# Altium schematic sheet obc_main_3.0.SchDoc: OBC Main
size A; DrawnBy: Mohamed Hirole; Organization: UTAT SS; DocumentNumber: 1; Revision: 1.0; SheetNumber: 1; SheetTotal: 8
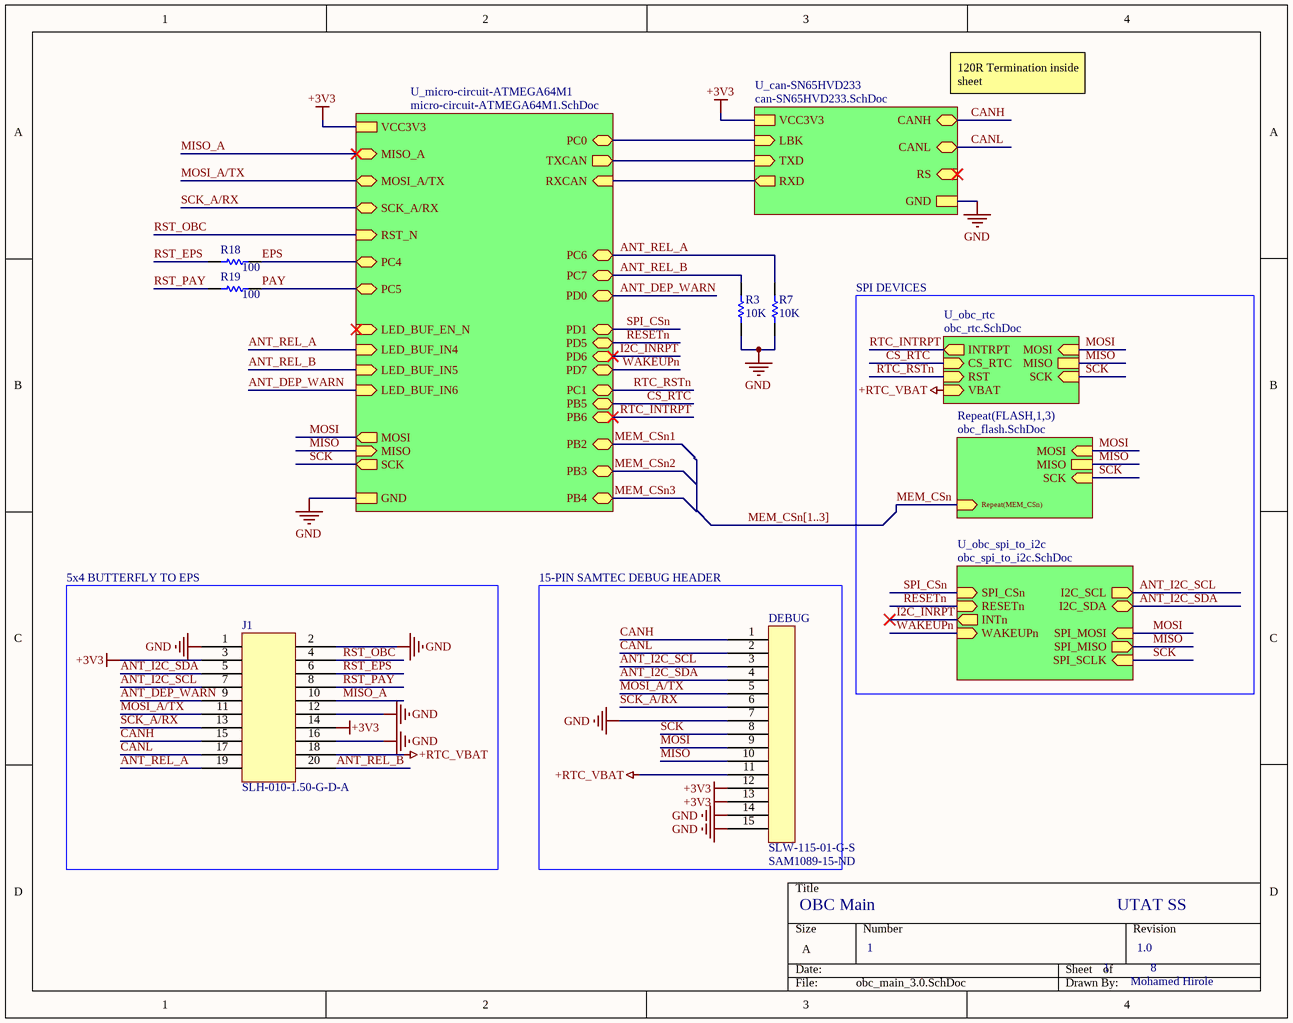
[diagram p0: obc_main_3.0.SchDoc]

## Parts
DEBUG  SLW-115-01-G-S  [SAM1089-15-ND]
J1  SLH-010-1.50-G-D-A  [SLH-010-1.50-G-D-A]
R3  value 10K  [RES0603R]  (hidden comment: 0603)
R7  value 10K  [RES0603R]  (hidden comment: 0603)
R18  value 100  [RES0603R]  (hidden comment: 0603)
R19  value 100  [RES0603R]  (hidden comment: 0603)

## Blocks framed on the sheet
5x4 BUTTERFLY TO EPS: J1
15-PIN SAMTEC DEBUG HEADER: DEBUG

## Sub-sheets
Repeat(FLASH,1,3) = obc_flash.SchDoc: MOSI (in), SCK (in), MISO, Repeat(MEM_CSn) (in)
U_can-SN65HVD233 = can-SN65HVD233.SchDoc: RXD (out), TXD (in), LBK (in), CANL (bidir), CANH (bidir), VCC3V3, GND, RS (in)
U_micro-circuit-ATMEGA64M1 = micro-circuit-ATMEGA64M1.SchDoc: MISO (in), MOSI (out), SCK (out), TXCAN (out), RXCAN (in), MISO_A (bidir), MOSI_A/TX (bidir), SCK_A/RX (bidir), PB2 (bidir), PB3 (bidir), PB4 (bidir), PB5 (bidir), PB6 (bidir), PC0 (bidir), PD0 (bidir), PC1 (bidir), PC4 (bidir), PC5 (bidir), PC6 (bidir), PC7 (bidir), PD1 (bidir), PD5 (bidir), PD6 (bidir), PD7 (bidir), RST_N (in), LED_BUF_EN_N (in), VCC3V3, GND, LED_BUF_IN4 (in), LED_BUF_IN5 (in), LED_BUF_IN6 (in)
U_obc_rtc = obc_rtc.SchDoc: CS_RTC (in), MOSI (in), MISO, SCK (in), INTRPT (out), VBAT (in), RST (in)
U_obc_spi_to_i2c = obc_spi_to_i2c.SchDoc: SPI_MOSI (in), I2C_SDA (bidir), INTn (out), WAKEUPn (in), RESETn (in), SPI_MISO (out), SPI_CSn (in), SPI_SCLK (in), I2C_SCL (out)

## Nets
+3V3: DEBUG.12 DEBUG.13 J1.3 J1.14 ; sheet U_micro-circuit-ATMEGA64M1/VCC3V3, sheet U_can-SN65HVD233/VCC3V3
+RTC_VBAT: DEBUG.11 J1.18 ; sheet U_obc_rtc/VBAT
GND: DEBUG.7 DEBUG.14 DEBUG.15 J1.1 J1.2 J1.12 J1.16 R3.1 R7.1 ; sheet U_micro-circuit-ATMEGA64M1/GND, sheet U_can-SN65HVD233/GND
ANT_DEP_WARN: J1.9 ; sheet U_micro-circuit-ATMEGA64M1/PD0, sheet U_micro-circuit-ATMEGA64M1/LED_BUF_IN6
ANT_I2C_SCL: DEBUG.3 J1.7 ; sheet U_obc_spi_to_i2c/I2C_SCL
ANT_I2C_SDA: DEBUG.4 J1.5 ; sheet U_obc_spi_to_i2c/I2C_SDA
ANT_REL_A: J1.19 R7.2 ; sheet U_micro-circuit-ATMEGA64M1/PC6, sheet U_micro-circuit-ATMEGA64M1/LED_BUF_IN4
ANT_REL_B: J1.20 R3.2 ; sheet U_micro-circuit-ATMEGA64M1/PC7, sheet U_micro-circuit-ATMEGA64M1/LED_BUF_IN5
CANH: DEBUG.1 J1.15 ; sheet U_can-SN65HVD233/CANH
CANL: DEBUG.2 J1.17 ; sheet U_can-SN65HVD233/CANL
CS_RTC: sheet U_obc_rtc/CS_RTC, sheet U_micro-circuit-ATMEGA64M1/PB5
EPS: R18.2 ; sheet U_micro-circuit-ATMEGA64M1/PC4
I2C_INRPT: sheet U_micro-circuit-ATMEGA64M1/PD6, sheet U_obc_spi_to_i2c/INTn
MEM_CSn: sheet Repeat(FLASH,1,3)/Repeat(MEM_CSn)
MEM_CSn1: sheet U_micro-circuit-ATMEGA64M1/PB2
MEM_CSn2: sheet U_micro-circuit-ATMEGA64M1/PB3
MEM_CSn3: sheet U_micro-circuit-ATMEGA64M1/PB4
MISO: DEBUG.10 ; sheet U_obc_rtc/MISO, sheet Repeat(FLASH,1,3)/MISO, sheet U_micro-circuit-ATMEGA64M1/MISO, sheet U_obc_spi_to_i2c/SPI_MISO
MISO_A: J1.10 ; sheet U_micro-circuit-ATMEGA64M1/MISO_A
MOSI: DEBUG.9 ; sheet U_obc_rtc/MOSI, sheet Repeat(FLASH,1,3)/MOSI, sheet U_micro-circuit-ATMEGA64M1/MOSI, sheet U_obc_spi_to_i2c/SPI_MOSI
MOSI_A/TX: DEBUG.5 J1.11 ; sheet U_micro-circuit-ATMEGA64M1/MOSI_A/TX
PAY: R19.2 ; sheet U_micro-circuit-ATMEGA64M1/PC5
RESETn: sheet U_micro-circuit-ATMEGA64M1/PD5, sheet U_obc_spi_to_i2c/RESETn
RST_EPS: J1.6 R18.1
RST_OBC: J1.4 ; sheet U_micro-circuit-ATMEGA64M1/RST_N
RST_PAY: J1.8 R19.1
RTC_INTRPT: sheet U_obc_rtc/INTRPT, sheet U_micro-circuit-ATMEGA64M1/PB6
RTC_RSTn: sheet U_obc_rtc/RST, sheet U_micro-circuit-ATMEGA64M1/PC1
SCK: DEBUG.8 ; sheet U_obc_rtc/SCK, sheet Repeat(FLASH,1,3)/SCK, sheet U_micro-circuit-ATMEGA64M1/SCK, sheet U_obc_spi_to_i2c/SPI_SCLK
SCK_A/RX: DEBUG.6 J1.13 ; sheet U_micro-circuit-ATMEGA64M1/SCK_A/RX
SPI_CSn: sheet U_micro-circuit-ATMEGA64M1/PD1, sheet U_obc_spi_to_i2c/SPI_CSn
WAKEUPn: sheet U_micro-circuit-ATMEGA64M1/PD7, sheet U_obc_spi_to_i2c/WAKEUPn
(unnamed): sheet U_micro-circuit-ATMEGA64M1/TXCAN, sheet U_can-SN65HVD233/TXD
(unnamed): sheet U_micro-circuit-ATMEGA64M1/RXCAN, sheet U_can-SN65HVD233/RXD
(unnamed): sheet U_micro-circuit-ATMEGA64M1/PC0, sheet U_can-SN65HVD233/LBK

## Buses and harness runs
bus MEM_CSn[1..3]

## Notes on the sheet
- 120R Termination inside sheet
- SPI DEVICES

## Library data of the parts
DEBUG = SLW-115-01-G-S: 15 Position Receptacle Connector 0.100" (2.54mm) Through Hole Gold; Manufacturer: Samtec; Max Current Rating: 7.1A; Contact Resistance: 10mR; Number of Positions: 15; Max Voltage Rating (AC): 550V; Gender: Female; Supplier 1: Digi-Key; Manufacturer Part Number: SLW-115-01-G-S; Stock 1: 0; Pricing 1: 1=2.44, 10=2.214, 25=2.0784, 50=1.988, 100=1.8976, 250=1.71684, 500=1.5813 (USD); Mount: Through Hole; Contact Plating: Gold; Contact Material: Bronze; Color: Black; Housing Color: Black; Housing Material: Polyester; Min Operating Temperature: -55°C; Max Operating Temperature: 125°C; Number of Rows: 1; Packaging: Bulk; Connector Type: Receptacle; Termination: Solder; Number of Contacts: 15; Orientation: Straight; Voltage Rating (AC): 550V; Package Quantity: 1; Length: 38.1mm; Pitch: 2.54mm; Depth: 2.54mm; Width: 2.54mm; Radiation Hardening: No; Lead Free: Lead Free; ComponentLink1URL: http://suddendocs.samtec.com/prints/slw-1xx-01-x-x-mkt.pdf?src-supplier=Digi-Key; ComponentLink1Description: http://suddendocs.samtec.com/prints/slw-1xx-01-x-x-mkt.pdf?src-supplier=Digi-Key; Supplier Part Number 1: SAM1089-15-ND
J1 = SLH-010-1.50-G-D-A: 0.50 mm Razor Beam™ LP Ultra Low Profile Socket Strip, alignment pin option; Supplier 1: SLH-010-1.50-G-D-A; Supplier Part Number 1: Samtec; ComponentLink1Description: Product Page; ComponentLink1URL: https://www.samtec.com/products/slh-010-1.50-g-d-a
R3 R7 R18 R19 = RES0603: 0603 resistor